# Altium project main_pcb_v1_0.PrjPcb (part 2 of 2)

## Sheet Operations_Microcontroller.SchDoc
size Letter; SheetNumber: 10; SheetTotal: 13
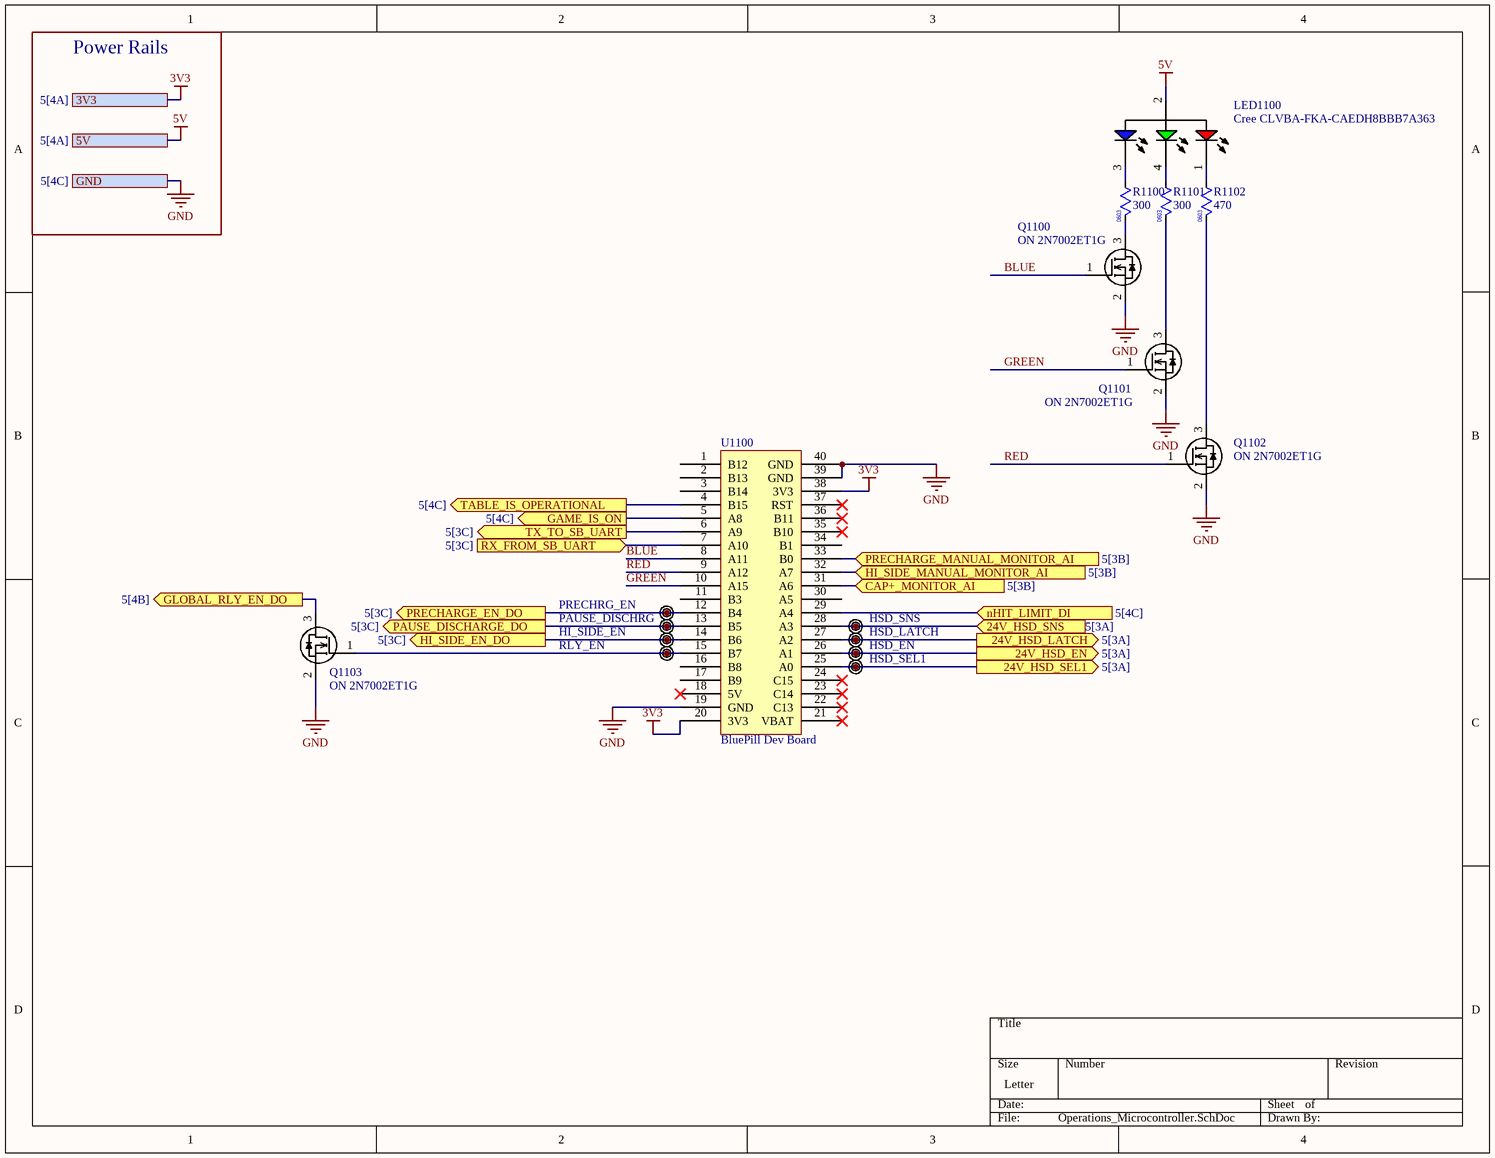
[diagram p8: Operations_Microcontroller.SchDoc]

### Parts
LED1100  Cree CLVBA-FKA-CAEDH8BBB7A363  [Cree CLVBA-FKA-Series (4-SOJ)]
Q1100  ON 2N7002ET1G  [ON SEMI 2N7002ET1G (SOT-23)]
Q1101  ON 2N7002ET1G  [ON SEMI 2N7002ET1G (SOT-23)]
Q1102  ON 2N7002ET1G  [ON SEMI 2N7002ET1G (SOT-23)]
Q1103  ON 2N7002ET1G  [ON SEMI 2N7002ET1G (SOT-23)]
R1100  value 300  [0603 Resistor Footprint]  (hidden comment: 0603 300 1% 0.33W)
R1101  value 300  [0603 Resistor Footprint]  (hidden comment: 0603 300 1% 0.33W)
R1102  value 470  [0603 Resistor Footprint]  (hidden comment: 0603 470R 5% 0.25W)
TP1100  PRECHRG_EN  [TESTPOINT]  (no BOM)
TP1101  PAUSE_DISCHRG  [TESTPOINT]  (no BOM)
TP1102  HSD_SNS  [TESTPOINT]  (no BOM)
TP1103  HI_SIDE_EN  [TESTPOINT]  (no BOM)
TP1104  HSD_LATCH  [TESTPOINT]  (no BOM)
TP1105  RLY_EN  [TESTPOINT]  (no BOM)
TP1106  HSD_EN  [TESTPOINT]  (no BOM)
TP1107  HSD_SEL1  [TESTPOINT]  (no BOM)
U1100  BluePill Dev Board  [Blue Pill]

### Ports
3V3 (see 5[4A]), 5V (see 5[4A]), 24V_HSD_EN (out, see 5[3A]), 24V_HSD_LATCH (out, see 5[3A]), 24V_HSD_SEL1 (out, see 5[3A]), 24V_HSD_SNS (in, see 5[3A]), CAP+_MONITOR_AI (in, see 5[3B]), GAME_IS_ON (out, see 5[4C]), GLOBAL_RLY_EN_DO (out, see 5[4B]), GND (see 5[4C]), HI_SIDE_EN_DO (out, see 5[3C]), HI_SIDE_MANUAL_MONITOR_AI (in, see 5[3B]), nHIT_LIMIT_DI (in, see 5[4C]), PAUSE_DISCHARGE_DO (out, see 5[3C]), PRECHARGE_EN_DO (out, see 5[3C]), PRECHARGE_MANUAL_MONITOR_AI (in, see 5[3B]), RX_FROM_SB_UART (in, see 5[3C]), TABLE_IS_OPERATIONAL (out, see 5[4C]), TX_TO_SB_UART (out, see 5[3C])

### Nets
3V3: U1100.20(3V3) U1100.38(3V3) ; port 3V3
5V: LED1100.2(COMMON_ANODE) ; port 5V
GND: Q1100.2(SOURCE) Q1101.2(SOURCE) Q1102.2(SOURCE) Q1103.2(SOURCE) U1100.19(GND) U1100.39(GND) U1100.40(GND) ; port GND
BLUE: Q1100.1(GATE) U1100.8(A11)
GREEN: Q1101.1(GATE) U1100.10(A15)
nHIT_LIMIT: Q1103.3(DRAIN) U1100.29(A4) ; port nHIT_LIMIT_DI, port GLOBAL_RLY_EN_DO
RED: Q1102.1(GATE) U1100.9(A12)
NetC202_2: TP1102.1(TP) U1100.28(A3) ; port 24V_HSD_SNS
NetD1000_3: U1100.31(A6) ; port CAP+_MONITOR_AI
NetD1001_3: U1100.32(A7) ; port HI_SIDE_MANUAL_MONITOR_AI
NetD1002_3: U1100.33(B0) ; port PRECHARGE_MANUAL_MONITOR_AI
NetLED1100_1: LED1100.1(RED) R1102.1
NetLED1100_3: LED1100.3(BLUE) R1100.1
NetLED1100_4: LED1100.4(GREEN) R1101.1
NetQ700_1: TP1100.1(TP) U1100.12(B4) ; port PRECHARGE_EN_DO
NetQ701_1: TP1103.1(TP) U1100.14(B6) ; port HI_SIDE_EN_DO
NetQ702_1: TP1101.1(TP) U1100.13(B5) ; port PAUSE_DISCHARGE_DO
NetQ1100_3: Q1100.3(DRAIN) R1100.2
NetQ1101_3: Q1101.3(DRAIN) R1101.2
NetQ1102_3: Q1102.3(DRAIN) R1102.2
NetQ1103_1: Q1103.1(GATE) TP1105.1(TP) U1100.15(B7)
NetR201_2: TP1107.1(TP) U1100.25(A0) ; port 24V_HSD_SEL1
NetR206_2: TP1104.1(TP) U1100.27(A2) ; port 24V_HSD_LATCH
NetR207_2: TP1106.1(TP) U1100.26(A1) ; port 24V_HSD_EN
NetTP1302_1: U1100.4(B15) ; port TABLE_IS_OPERATIONAL
NetTP1304_1: U1100.5(A8) ; port GAME_IS_ON
NetU800_11: U1100.6(A9) ; port TX_TO_SB_UART
NetU800_12: U1100.7(A10) ; port RX_FROM_SB_UART

Not connected (* = marked no-connect by the designer): U1100 1(B12) 2(B13) 3(B14) 11(B3) 16(B8) 17(B9) 18(5V)* 21(VBAT)* 22(C13)* 23(C14)* 24(C15)* 30(A5) 34(B1) 35(B10)* 36(B11)* 37(RST)*

### Notes on the sheet
- Power Rails

### Library data of the parts
LED1100 = CMP-026-000010-1: LED RGB DIFFUSED 4PLCC SMD; Supplier 1: Digi-Key; Design Item ID: Cree CLVBA-FKA-CAEDH8BBB7A363; Source: UBC Formula Electric.SchLib; Supplier Part Number 1: CLVBA-FKA-CAEDH8BBB7A363CT-ND
Q1100-Q1103 = CMP-016-000005-1: MOSFET N-CH 60V 260MA SOT23-3; Design Item ID: ON 2N7002ET1G; Source: UBC Formula Electric.SchLib; Supplier 1: Digi-Key; Supplier Part Number 1: 2N7002ET1GOSCT-ND
R1100 R1101 = CMP-009-00191-7: RES SMD 300 OHM 1% 1/3W 0603; Manufacturer Part Number: CRCW0603300RFKEAHP; Power: 250mW; Pins: 2; Digikey Part Number: 541-CRCW0603300RFKEAHPCT-ND; Max Operating Temperature: 155°C; Min Operating Temperature: -55°C; Case/Package: 0603; RoHS Compliant: Yes; Mounting Technology: Surface Mount; Tolerance: 1%
R1102 = CMP-009-00193-4: Res Thick Film 0603 470 Ohm 5% 0.25W(1/4W) ±200ppm/C Pad SMD Automotive T/R; Manufacturer Part Number: ERJ-PA3J471V; Power: 250mW; Tolerance: 5%; Max Operating Temperature: 155°C; Digikey Part Number: P470BZCT-ND; Case/Package: 0603; Mounting Technology: Surface Mount; Pins: 2; RoHS Compliant: Yes; Min Operating Temperature: -55°C
TP1100-TP1107 = CMP-020-0000-4: Source: UBC Formula Electric.SchLib; Design Item ID: Thru-Hole Test Point

## Sheet MAX3232.SchDoc
size Letter; SheetNumber: 7; SheetTotal: 13
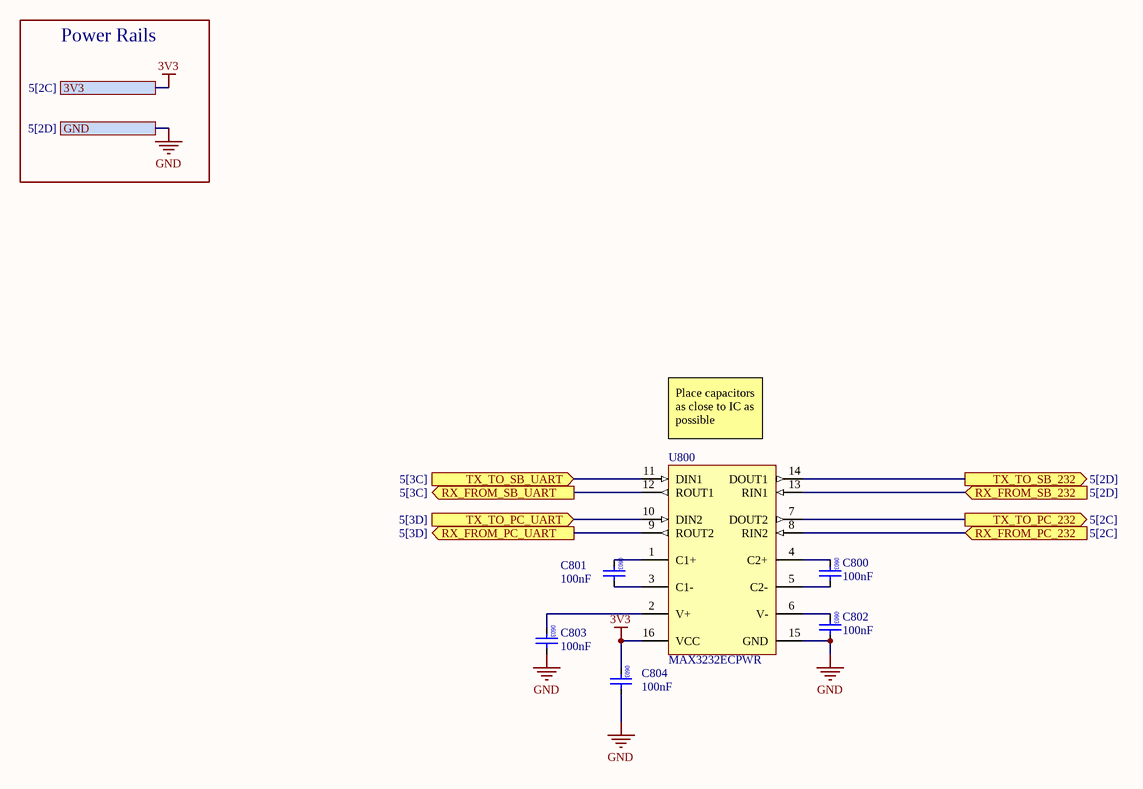
[diagram p9: MAX3232.SchDoc]

### Parts
C800  value 100nF  [0603 Capacitor Footprint]  (hidden comment: 0603 0.1uF 5% 50V)
C801  value 100nF  [0603 Capacitor Footprint]  (hidden comment: 0603 0.1uF 5% 50V)
C802  value 100nF  [0603 Capacitor Footprint]  (hidden comment: 0603 0.1uF 5% 50V)
C803  value 100nF  [0603 Capacitor Footprint]  (hidden comment: 0603 0.1uF 5% 50V)
C804  value 100nF  [0603 Capacitor Footprint]  (hidden comment: 0603 0.1uF 5% 50V)
U800  MAX3232ECPWR  [PW0016A_M]

### Ports
3V3 (see 5[2C]), GND (see 5[2D]), RX_FROM_PC_232 (in, see 5[2C]), RX_FROM_PC_UART (out, see 5[3D]), RX_FROM_SB_232 (in, see 5[2D]), RX_FROM_SB_UART (out, see 5[3C]), TX_TO_PC_232 (out, see 5[2C]), TX_TO_PC_UART (in, see 5[3D]), TX_TO_SB_232 (out, see 5[2D]), TX_TO_SB_UART (in, see 5[3C])

### Nets
3V3: C804.2 U800.16(VCC) ; port 3V3
GND: C802.1 C803.1 C804.1 U800.15(GND) ; port GND
NetC800_1: C800.1 U800.5(C2-)
NetC800_2: C800.2 U800.4(C2+)
NetC801_1: C801.1 U800.3(C1-)
NetC801_2: C801.2 U800.1(C1+)
NetC802_2: C802.2 U800.6(V-)
NetC803_2: C803.2 U800.2(V+)
NetJ508_2: U800.8(RIN2) ; port RX_FROM_PC_232
NetJ508_3: U800.7(DOUT2) ; port TX_TO_PC_232
NetJ510_2: U800.13(RIN1) ; port RX_FROM_SB_232
NetJ510_3: U800.14(DOUT1) ; port TX_TO_SB_232
NetU800_9: U800.9(ROUT2) ; port RX_FROM_PC_UART
NetU800_10: U800.10(DIN2) ; port TX_TO_PC_UART
NetU800_11: U800.11(DIN1) ; port TX_TO_SB_UART
NetU800_12: U800.12(ROUT1) ; port RX_FROM_SB_UART

### Notes on the sheet
- Power Rails
- (near U800) Place capacitors as close to IC as possible

### Library data of the parts
C800-C804 = CMP-001-00091-5: CAP CER 0.1UF 50V X7R 0603; Manufacturer Part Number: CC0603JPX7R9BB104; Capacitor Type: Ceramic; Case/Package: 0603; Tolerance: 5%; Voltage Rating: 50V; Mounting Technology: SF
U800 = CMP-0299-01479-2: 3-V to 5.5-V Multichannel RS-232 Line Driver / Receiver with ±15-kV IEC ESD Protection, 0 to 70 degC, 16-Pin TSSOP (PW), Green (RoHS & no Sb/Br); Supply Voltage(s)(V): 3.3 or 5.0; Receivers Per Package: 2; ESD HBM(kV): +/-15; IEC-61000-4-2 SUPPORT: TRUE; ICC(Max)(mA): 1; ComponentLink2Description: Datasheet; PackageVersion: revG, Feb-2011; ComponentLink3Description: Package Specification; DatasheetVersion: SLLS664A; Drivers Per Package: 2; PackageDescription: 16-Pin Plastic Thin Small Outline Package 5 x 4.4 mm Body ,0.65 mm Pitch; ComponentLink3URL: http://www.ti.com/litv/pdf/mpds361; ComponentLink1Description: Manufacturer URL; ComponentLink2URL: http://www.ti.com/general/docs/lit/getliterature.tsp?genericPartNumber=MAX3232E&fileType=pdf; PackageReference: PW0016A; RS-232: TRUE; SubFamily: RS-232; Single Supply: TRUE; ComponentLink1URL: www.ti.com

## Sheet Controls_Architecture.SchDoc
size Letter; SheetNumber: 11; SheetTotal: 13
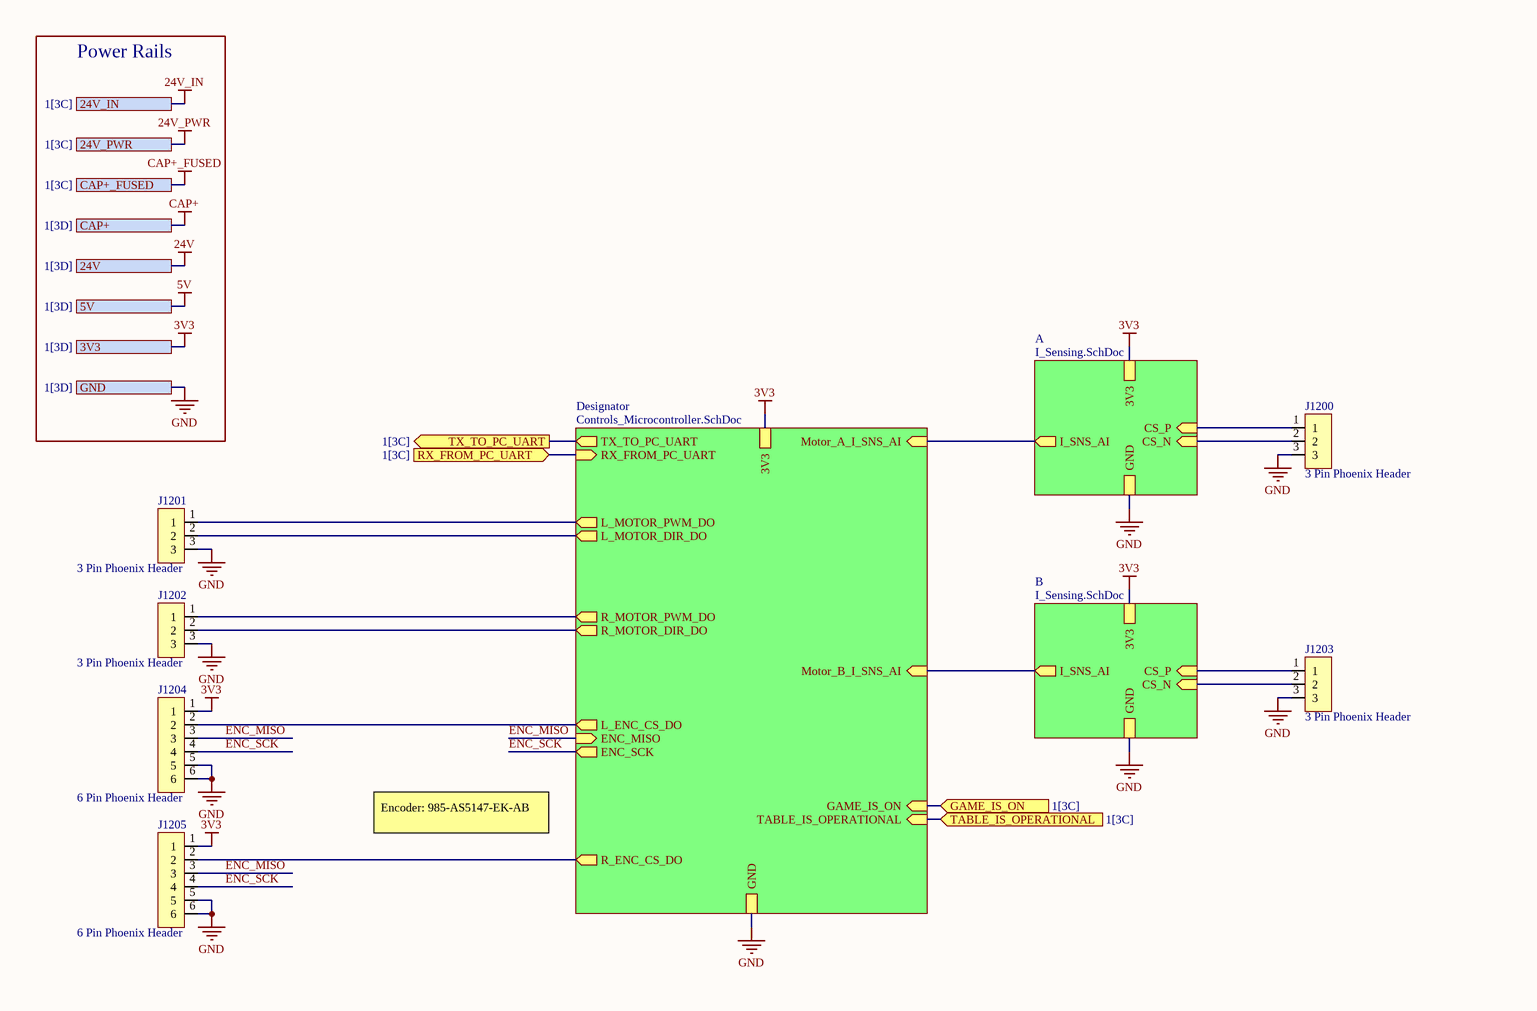
[diagram p10: Controls_Architecture.SchDoc, left]
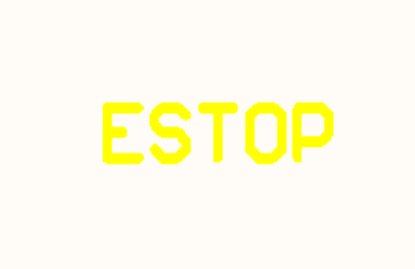
[diagram p11: Controls_Architecture.SchDoc, right]

### Parts
J1200  3 Pin Phoenix Header  [3 Pin Phoenix Header]
J1201  3 Pin Phoenix Header  [3 Pin Phoenix Header]
J1202  3 Pin Phoenix Header  [3 Pin Phoenix Header]
J1203  3 Pin Phoenix Header  [3 Pin Phoenix Header]
J1204  6 Pin Phoenix Header  [6 Pin Phoenix Header]
J1205  6 Pin Phoenix Header  [6 Pin Phoenix Header]

### Sub-sheets
A = I_Sensing.SchDoc: I_SNS_AI (out), CS_P (in), CS_N (in), 3V3, GND
B = I_Sensing.SchDoc: I_SNS_AI (out), CS_P (in), CS_N (in), 3V3, GND
Designator = Controls_Microcontroller.SchDoc: TX_TO_PC_UART (out), RX_FROM_PC_UART (in), Motor_A_I_SNS_AI (in), Motor_B_I_SNS_AI (in), L_MOTOR_PWM_DO (out), L_MOTOR_DIR_DO (out), R_MOTOR_PWM_DO (out), R_MOTOR_DIR_DO (out), ENC_SCK (out), L_ENC_CS_DO (out), R_ENC_CS_DO (out), ENC_MISO (in), GAME_IS_ON (in), TABLE_IS_OPERATIONAL (in), 3V3, GND

### Ports
3V3 (see 1[3D]), 5V (see 1[3D]), 24V (see 1[3D]), 24V_IN (see 1[3C]), 24V_PWR (see 1[3C]), CAP+ (see 1[3D]), CAP+_FUSED (see 1[3C]), GAME_IS_ON (in, see 1[3C]), GND (see 1[3D]), RX_FROM_PC_UART (in, see 1[3C]), TABLE_IS_OPERATIONAL (in, see 1[3C]), TX_TO_PC_UART (out, see 1[3C])

### Nets
3V3: J1204.1 J1205.1 ; port 3V3, sheet Designator/3V3, sheet A/3V3, sheet B/3V3
GND: J1200.3 J1201.3 J1202.3 J1203.3 J1204.5 J1204.6 J1205.5 J1205.6 ; port GND, sheet Designator/GND, sheet A/GND, sheet B/GND
ENC_MISO: J1204.3 J1205.3 ; sheet Designator/ENC_MISO
ENC_SCK: J1204.4 J1205.4 ; sheet Designator/ENC_SCK
NetJ1200_1: J1200.1 ; sheet A/CS_P
NetJ1200_2: J1200.2 ; sheet A/CS_N
NetJ1201_1: J1201.1 ; sheet Designator/L_MOTOR_PWM_DO
NetJ1201_2: J1201.2 ; sheet Designator/L_MOTOR_DIR_DO
NetJ1202_1: J1202.1 ; sheet Designator/R_MOTOR_PWM_DO
NetJ1202_2: J1202.2 ; sheet Designator/R_MOTOR_DIR_DO
NetJ1203_1: J1203.1 ; sheet B/CS_P
NetJ1203_2: J1203.2 ; sheet B/CS_N
NetJ1204_2: J1204.2 ; sheet Designator/L_ENC_CS_DO
NetJ1205_2: J1205.2 ; sheet Designator/R_ENC_CS_DO
NetTP1302_1: port TABLE_IS_OPERATIONAL, sheet Designator/TABLE_IS_OPERATIONAL
NetTP1304_1: port GAME_IS_ON, sheet Designator/GAME_IS_ON
NetTP1306_1: sheet Designator/Motor_B_I_SNS_AI, sheet B/I_SNS_AI
NetTP1307_1: sheet Designator/Motor_A_I_SNS_AI, sheet A/I_SNS_AI
NetU800_9: port RX_FROM_PC_UART, sheet Designator/RX_FROM_PC_UART
NetU800_10: port TX_TO_PC_UART, sheet Designator/TX_TO_PC_UART

### Notes on the sheet
- Power Rails
- Encoder: 985-AS5147-EK-AB

## Sheet Controls_Microcontroller.SchDoc
size Letter; SheetNumber: 12; SheetTotal: 13
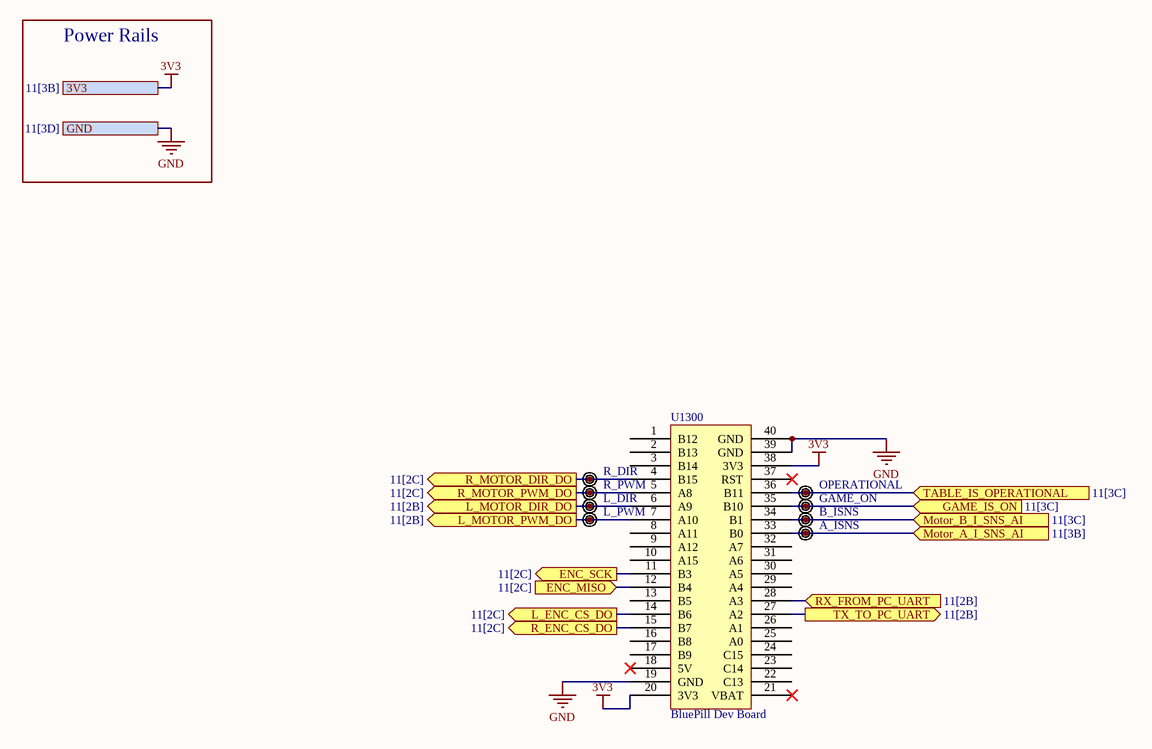
[diagram p12: Controls_Microcontroller.SchDoc]

### Parts
TP1300  R_DIR  [TESTPOINT]  (no BOM)
TP1301  R_PWM  [TESTPOINT]  (no BOM)
TP1302  OPERATIONAL  [TESTPOINT]  (no BOM)
TP1303  L_DIR  [TESTPOINT]  (no BOM)
TP1304  GAME_ON  [TESTPOINT]  (no BOM)
TP1305  L_PWM  [TESTPOINT]  (no BOM)
TP1306  B_ISNS  [TESTPOINT]  (no BOM)
TP1307  A_ISNS  [TESTPOINT]  (no BOM)
U1300  BluePill Dev Board  [Blue Pill]

### Ports
3V3 (see 11[3B]), ENC_MISO (in, see 11[2C]), ENC_SCK (out, see 11[2C]), GAME_IS_ON (in, see 11[3C]), GND (see 11[3D]), L_ENC_CS_DO (out, see 11[2C]), L_MOTOR_DIR_DO (out, see 11[2B]), L_MOTOR_PWM_DO (out, see 11[2B]), Motor_A_I_SNS_AI (in, see 11[3B]), Motor_B_I_SNS_AI (in, see 11[3C]), R_ENC_CS_DO (out, see 11[2C]), R_MOTOR_DIR_DO (out, see 11[2C]), R_MOTOR_PWM_DO (out, see 11[2C]), RX_FROM_PC_UART (in, see 11[2B]), TABLE_IS_OPERATIONAL (in, see 11[3C]), TX_TO_PC_UART (out, see 11[2B])

### Nets
3V3: U1300.20(3V3) U1300.38(3V3) ; port 3V3
GND: U1300.19(GND) U1300.39(GND) U1300.40(GND) ; port GND
ENC_MISO: U1300.12(B4) ; port ENC_MISO
ENC_SCK: U1300.11(B3) ; port ENC_SCK
NetJ1201_1: TP1305.1(TP) U1300.7(A10) ; port L_MOTOR_PWM_DO
NetJ1201_2: TP1303.1(TP) U1300.6(A9) ; port L_MOTOR_DIR_DO
NetJ1202_1: TP1301.1(TP) U1300.5(A8) ; port R_MOTOR_PWM_DO
NetJ1202_2: TP1300.1(TP) U1300.4(B15) ; port R_MOTOR_DIR_DO
NetJ1204_2: U1300.14(B6) ; port L_ENC_CS_DO
NetJ1205_2: U1300.15(B7) ; port R_ENC_CS_DO
NetTP1302_1: TP1302.1(TP) U1300.36(B11) ; port TABLE_IS_OPERATIONAL
NetTP1304_1: TP1304.1(TP) U1300.35(B10) ; port GAME_IS_ON
NetTP1306_1: TP1306.1(TP) U1300.34(B1) ; port Motor_B_I_SNS_AI
NetTP1307_1: TP1307.1(TP) U1300.33(B0) ; port Motor_A_I_SNS_AI
NetU800_9: U1300.28(A3) ; port RX_FROM_PC_UART
NetU800_10: U1300.27(A2) ; port TX_TO_PC_UART

Not connected (* = marked no-connect by the designer): U1300 1(B12) 2(B13) 3(B14) 8(A11) 9(A12) 10(A15) 13(B5) 16(B8) 17(B9) 18(5V)* 21(VBAT)* 22(C13) 23(C14) 24(C15) 25(A0) 26(A1) 29(A4) 30(A5) 31(A6) 32(A7) 37(RST)*

### Notes on the sheet
- Power Rails

### Library data of the parts
TP1300-TP1307 = CMP-020-0000-4: Source: UBC Formula Electric.SchLib; Design Item ID: Thru-Hole Test Point

## Sheet I_Sensing.SchDoc
size Letter; SheetNumber: 13; SheetTotal: 13
Used 2 times, as channels Designator/A, Designator/B. Parts and nets are listed once, with the designators drawn on the sheet.
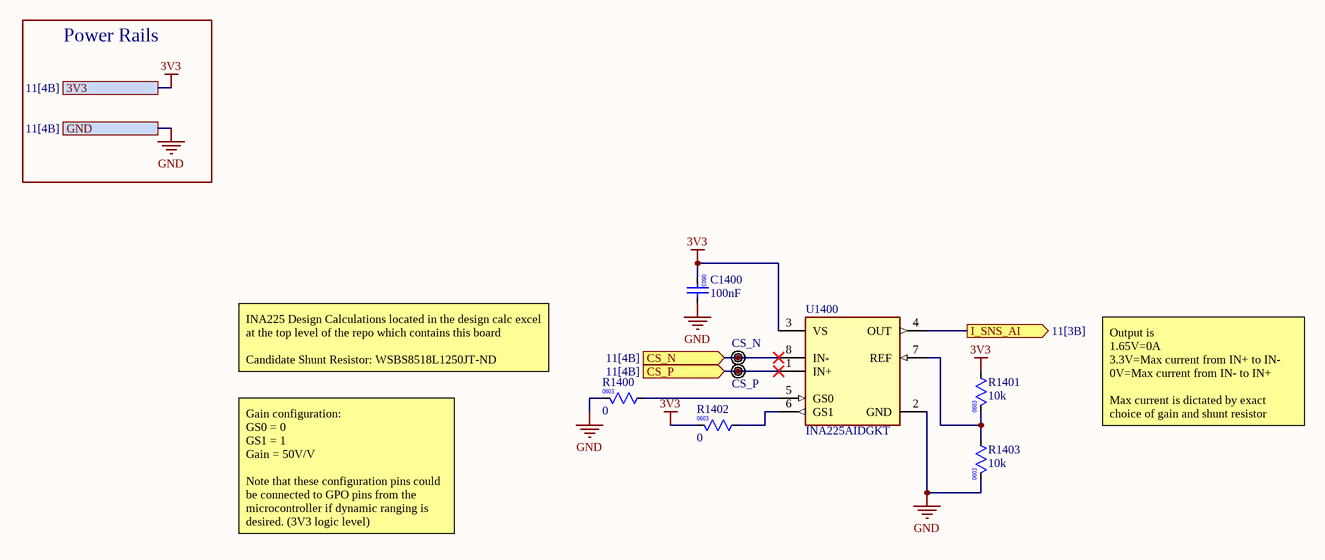
[diagram p13: I_Sensing.SchDoc]

### Parts
C1400  value 100nF  [0603 Capacitor Footprint]  (hidden comment: 0603 0.1uF 5% 50V)
R1400  value 0  [RESC0603(1608)_L]  (hidden comment: Jumper 0603)
R1401  value 10k  [0603 Resistor Footprint]  (hidden comment: 0603 10k 1% 0.3W)
R1402  value 0  [RESC0603(1608)_L]  (hidden comment: Jumper 0603)
R1403  value 10k  [0603 Resistor Footprint]  (hidden comment: 0603 10k 1% 0.3W)
TP1400  CS_N  [TESTPOINT]  (no BOM)
TP1401  CS_P  [TESTPOINT]  (no BOM)
U1400  INA225AIDGKT  [FP-INA225AIDGKT-MFG]

### Ports
3V3 (see 11[4B]), CS_N (in, see 11[4B]), CS_P (in, see 11[4B]), GND (see 11[4B]), I_SNS_AI (out, see 11[3B])

### Nets
3V3: C1400.2 R1401.1 R1402.2 U1400.3(VS) ; port 3V3
GND: C1400.1 R1400.2 R1403.2 U1400.2(GND) ; port GND
CS_N: TP1400.1(TP) U1400.8(IN-) ; port CS_N
CS_P: TP1401.1(TP) U1400.1(IN+) ; port CS_P
I_SNS_AI: U1400.4(OUT) ; port I_SNS_AI
NetR1400_1: R1400.1 U1400.5(GS0)
NetR1401_2: R1401.2 R1403.1 U1400.7(REF)
NetR1402_1: R1402.1 U1400.6(GS1)

### Channels
Designator/A: designators end in _A; ports 3V3=3V3 CS_N=NetJ1200_2 CS_P=NetJ1200_1 GND=GND I_SNS_AI=NetTP1307_1
Designator/B: designators end in _B; ports 3V3=3V3 CS_N=NetJ1203_2 CS_P=NetJ1203_1 GND=GND I_SNS_AI=NetTP1306_1

### Notes on the sheet
- Power Rails
- INA225 Design Calculations located in the design calc excel at the top level of the repo which contains this board
  Candidate Shunt Resistor: WSBS8518L1250JT-ND
- Output is
  1.65V=0A
  3.3V=Max current from IN+ to IN-
  0V=Max current from IN- to IN+
  Max current is dictated by exact choice of gain and shunt resistor
- Gain configuration:
  GS0 = 0
  GS1 = 1
  Gain = 50V/V
  Note that these configuration pins could be connected to GPO pins from the microcontroller if dynamic ranging is desired. (3V3 logic level)

### Library data of the parts
C1400 = CMP-001-00091-5: as C800 on sheet MAX3232; Case/Package: 0603; Tolerance: 5%; Mounting Technology: SF; Voltage Rating: 50V
R1400 R1402 = CMP-009-00175-6: Pins: 2; Case/Package: 0603; Max Operating Temperature: 155°C; Min Operating Temperature: -55°C
R1401 R1403 = CMP-009-00181-10: RES SMD 10K OHM 1% 1/3W 0603; Manufacturer Part Number: CRCW060310K0FKEAHP; Power: 333mW; Pins: 2; Tolerance: 1%; Max Operating Temperature: 155°C; RoHS Compliant: Yes; Min Operating Temperature: -55°C; Mounting Technology: Surface Mount; Case/Package: 0603; Digikey Part Number: 541-10.0KSCT-ND
TP1400 TP1401 = CMP-020-0000-4: Source: UBC Formula Electric.SchLib; Design Item ID: Thru-Hole Test Point
U1400 = CMP-04895-000038-1: IC MONITOR PWR/CUR BIDIR 8VSSOP; Manufacturer: Texas Instruments; Nominal Supply Current: 300uA; Input Bias Current: 72uA; Bandwidth: 250kHz; Number Of Channels: 1; Voltage Gain: 0.025/0.05/0.1/0.2V/mV; Standoff Height: 0.05mm; Min Supply Voltage: 2.7V; Input Offset Voltage: 0.075mV; Max Junction Temp: +150°C; Max Supply Voltage: 36V; Ipc Land Pattern Name: SOIC65P490X110-8; Device Class L2: Linear ICs; Automotive: No; Ambient Temperature Range Low: -40°C; Octopart: https://octopart.com/ina225aidgkt-texas+instruments-28946314; Ambient Temperature Range High: +125°C; RoHS: TRUE; Height: 1.1mm; Temperature Range High: +125°C; Package: VSSOP8; Temperature Range Low: -40°C; Temperature: -40°C to +125°C; Lead Free: Yes; Digikey Description: IC MONITOR PWR/CUR BIDIR 8VSSOP; Device Class L1: Integrated Circuits (ICs); Mouser Description: Current Sense Amplifiers 36V Bidir 0-Drift Ser Crnt-Shunt Mon; Device Class L3: Instrumentation; Manufacturer Part Number: INA225AIDGKT; Category: IC; ComponentLink2Description: Datasheet; ComponentLink2URL: http://www.ti.com/lit/ds/symlink/ina225.pdf

## Nets that join several sheets
3V3: Power_Architecture (U200.16), 3V3_Regulator (C401.2 R400.1 TP400.1 U400.5), Monitoring (D1000.2 D1001.2 D1002.2), Shutdown_Nodes (R913.1), Operations_Microcontroller (U1100.20 U1100.38), MAX3232 (C804.2 U800.16), Controls_Architecture (J1204.1 J1205.1), Controls_Microcontroller (U1300.20 U1300.38), Designator/A (C1400_A.2 R1401_A.1 R1402_A.2 U1400_A.3), Designator/B (C1400_B.2 R1401_B.1 R1402_B.2 U1400_B.3)
5V: 5V_Regulator (6 pins), 3V3_Regulator (C400.2 U400.1 U400.3), Operations_Microcontroller (LED1100.2)
24V: Power_Architecture (5 pins), 5V_Regulator (C303.2 U300.2 U300.3), Relay_Control (Q702.2 R706.1), Shutdown_Nodes (S900.2)
CAP+_FUSED: Power_Architecture (J201.1 K200.4), Monitoring (R1000.1)
GND: Top_Level (6 pins), Power_Architecture (18 pins), 5V_Regulator (5 pins), 3V3_Regulator (C400.1 C401.1 D400.2 U400.2), Operations_Architecture (8 pins), Relay_Control (11 pins), Monitoring (6 pins), Shutdown_Nodes (13 pins), Operations_Microcontroller (7 pins), MAX3232 (C802.1 C803.1 C804.1 U800.15), Controls_Architecture (8 pins), Controls_Microcontroller (U1300.19 U1300.39 U1300.40), Designator/A (C1400_A.1 R1400_A.2 R1403_A.2 U1400_A.2), Designator/B (C1400_B.1 R1400_B.2 R1403_B.2 U1400_B.2)
DISCHARGE_COIL: Power_Architecture (K202.2), Relay_Control (D704.1 D706.1 D707.1 R704.2)
ENC_MISO: Controls_Architecture (J1204.3 J1205.3), Controls_Microcontroller (U1300.12)
ENC_SCK: Controls_Architecture (J1204.4 J1205.4), Controls_Microcontroller (U1300.11)
HI_SIDE_COIL_CURRENT: Power_Architecture (K200.2), Relay_Control (D701.1 Q701.4 R707.2)
HI_SIDE_MANUAL_COIL_CURRENT: Relay_Control (Q701.2 R702.1 S700.3), Monitoring (R1003.1)
NetC202_2: Power_Architecture (C202.2 R202.2), Operations_Microcontroller (TP1102.1 U1100.28)
NetD901_1: Operations_Architecture (J500.1), Shutdown_Nodes (D901.1 Q900.4)
NetD902_1: Operations_Architecture (J500.2 J501.1), Shutdown_Nodes (D902.1)
NetD903_1: Operations_Architecture (J501.2), Shutdown_Nodes (D903.1 Q901.2 R900.1 R908.1)
NetD1000_3: Monitoring (D1000.3 R1001.2 R1002.1 TP1000.1), Operations_Microcontroller (U1100.31)
NetD1001_3: Monitoring (D1001.3 R1004.2 R1005.1 TP1001.1), Operations_Microcontroller (U1100.32)
NetD1002_3: Monitoring (D1002.3 R1007.2 R1008.1 TP1002.1), Operations_Microcontroller (U1100.33)
NetJ508_2: Operations_Architecture (J508.2), MAX3232 (U800.8)
NetJ508_3: Operations_Architecture (J508.3), MAX3232 (U800.7)
NetJ510_2: Operations_Architecture (J510.2), MAX3232 (U800.13)
NetJ510_3: Operations_Architecture (J510.3), MAX3232 (U800.14)
NetJ1200_1: Controls_Architecture (J1200.1), Designator/A (TP1401_A.1 U1400_A.1)
NetJ1200_2: Controls_Architecture (J1200.2), Designator/A (TP1400_A.1 U1400_A.8)
NetJ1201_1: Controls_Architecture (J1201.1), Controls_Microcontroller (TP1305.1 U1300.7)
NetJ1201_2: Controls_Architecture (J1201.2), Controls_Microcontroller (TP1303.1 U1300.6)
NetJ1202_1: Controls_Architecture (J1202.1), Controls_Microcontroller (TP1301.1 U1300.5)
NetJ1202_2: Controls_Architecture (J1202.2), Controls_Microcontroller (TP1300.1 U1300.4)
NetJ1203_1: Controls_Architecture (J1203.1), Designator/B (TP1401_B.1 U1400_B.1)
NetJ1203_2: Controls_Architecture (J1203.2), Designator/B (TP1400_B.1 U1400_B.8)
NetJ1204_2: Controls_Architecture (J1204.2), Controls_Microcontroller (U1300.14)
NetJ1205_2: Controls_Architecture (J1205.2), Controls_Microcontroller (U1300.15)
NetQ700_1: Relay_Control (Q700.1), Operations_Microcontroller (TP1100.1 U1100.12)
NetQ701_1: Relay_Control (Q701.1), Operations_Microcontroller (TP1103.1 U1100.14)
NetQ702_1: Relay_Control (Q702.1), Operations_Microcontroller (TP1101.1 U1100.13)
NetR201_2: Power_Architecture (R201.2), Operations_Microcontroller (TP1107.1 U1100.25)
NetR206_2: Power_Architecture (R206.2), Operations_Microcontroller (TP1104.1 U1100.27)
NetR207_2: Power_Architecture (R207.2), Operations_Microcontroller (TP1106.1 U1100.26)
NetTP1302_1: Operations_Microcontroller (U1100.4), Controls_Microcontroller (TP1302.1 U1300.36)
NetTP1304_1: Operations_Microcontroller (U1100.5), Controls_Microcontroller (TP1304.1 U1300.35)
NetTP1306_1: Controls_Microcontroller (TP1306.1 U1300.34), Designator/B (U1400_B.4)
NetTP1307_1: Controls_Microcontroller (TP1307.1 U1300.33), Designator/A (U1400_A.4)
NetU800_9: MAX3232 (U800.9), Controls_Microcontroller (U1300.28)
NetU800_10: MAX3232 (U800.10), Controls_Microcontroller (U1300.27)
NetU800_11: Operations_Microcontroller (U1100.6), MAX3232 (U800.11)
NetU800_12: Operations_Microcontroller (U1100.7), MAX3232 (U800.12)
nHIT_LIMIT: Operations_Architecture (6 pins), Shutdown_Nodes (Q900.1 R913.2 TP902.1), Operations_Microcontroller (Q1103.3 U1100.29)
nSHDN: Operations_Architecture (J505.1), Relay_Control (D702.1 D704.2 R709.2 S700.2), Shutdown_Nodes (Q901.4)
PRECHARGE_COIL_CURRENT: Power_Architecture (K201.2), Relay_Control (D700.1 Q700.4 R705.2)
PRECHARGE_MANUAL_COIL_CURRENT: Relay_Control (Q700.2 R700.1 S700.1), Monitoring (R1006.1)